# EAGLE design CC110L_Breakout (EAGLE 7.1.0)
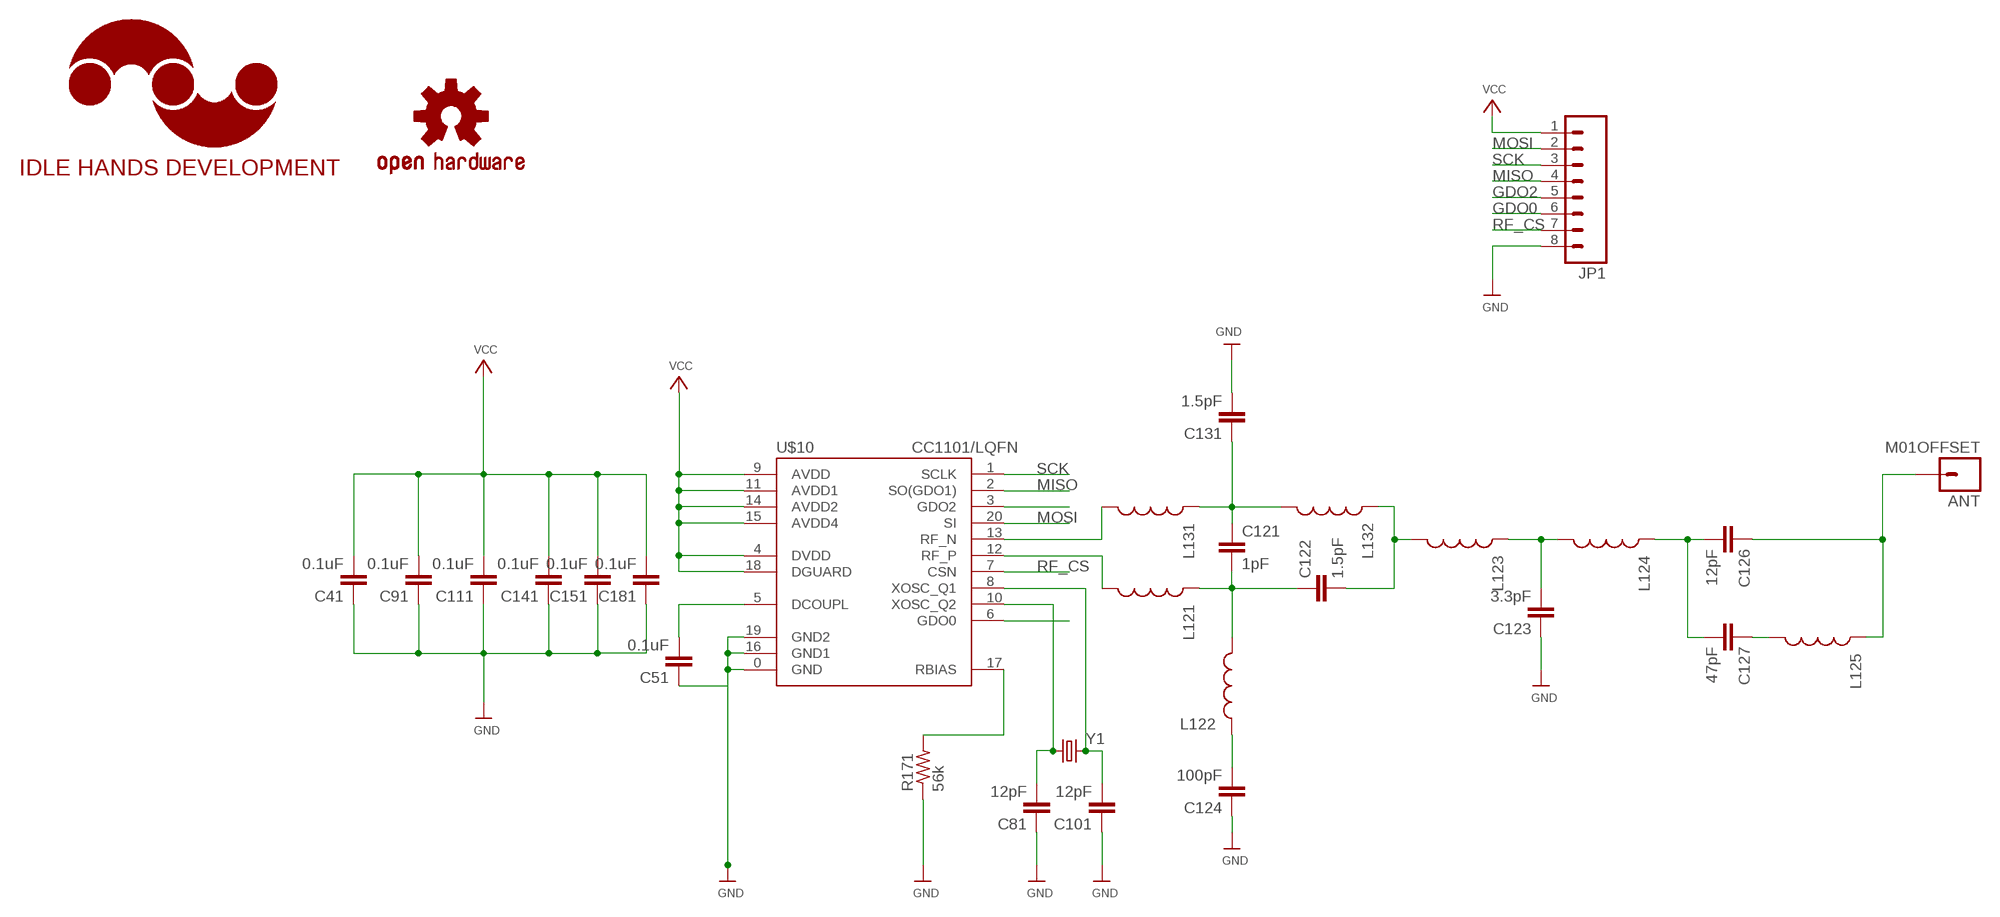
[diagram p0: schematic, sheet 1]

## Parts
ANT  M01OFFSET  [1X01_OFFSET]
C41  0.1uF  C-EUC0402  [C0402]
C51  0.1uF  C-EUC0402  [C0402]
C81  12pF  C-EUC0402  [C0402]
C91  0.1uF  C-EUC0402  [C0402]
C101  12pF  C-EUC0402  [C0402]
C111  0.1uF  C-EUC0402  [C0402]
C121  1pF  C-EUC0402  [C0402]
C122  1.5pF  C-EUC0402  [C0402]
C123  3.3pF  C-EUC0402  [C0402]
C124  100pF  C-EUC0402  [C0402]
C126  12pF  C-EUC0402  [C0402]
C127  47pF  C-EUC0402  [C0402]
C131  1.5pF  C-EUC0402  [C0402]
C141  0.1uF  C-EUC0402  [C0402]
C151  0.1uF  C-EUC0402  [C0402]
C181  0.1uF  C-EUC0402  [C0402]
JP1  M08LOCK  [1X08_LOCK]
L121  INDUCTOR0402  [C0402]
L122  INDUCTOR0402  [C0402]
L123  INDUCTOR0402  [C0402]
L124  INDUCTOR0402  [C0402]
L125  INDUCTOR0402  [C0402]
L131  INDUCTOR0402  [C0402]
L132  INDUCTOR0402  [C0402]
LOGO1  OSHW-LOGOS  [OSHW-LOGO-S]
LOGO2  IDLEHANDS_LOGOS  [IHD-LOGO-S]
R171  56k  R-US_R0402  [R0402]
U$10  CC1101/LQFN  [QFN20]
Y1  CRYSTAL3.2X2.5  [CRYSTAL-SMD-3.2X2.5]

## Nets
GDO0: JP1.6 U$10.6(GDO0)
GDO2: JP1.5 U$10.3(GDO2)
GND: C41.1 C51.1 C81.1 C91.1 C101.1 C111.1 C123.1 C124.1 C131.2 C141.1 C151.1 C181.1 JP1.8 R171.1 U$10.0(GND) U$10.16(GND1) U$10.19(GND2)
MISO: JP1.4 U$10.2(SO(GDO1))
MOSI: JP1.2 U$10.20(SI)
N$1: L131.2 U$10.13(RF_N)
N$2: C121.1 C131.1 L131.1 L132.2
N$4: L121.2 U$10.12(RF_P)
N$5: C121.2 C122.1 L121.1 L122.2
N$6: C124.2 L122.1
N$7: C122.2 L123.2 L132.1
N$8: C123.2 L123.1 L124.2
N$9: C126.2 C127.2 L124.1
N$10: C127.1 L125.2
N$11: ANT.1 C126.1 L125.1
N$12: C101.2 U$10.8(XOSC_Q1) Y1.3
N$13: C81.2 U$10.10(XOSC_Q2) Y1.1
N$14: C51.2 U$10.5(DCOUPL)
N$16: R171.2 U$10.17(RBIAS)
RF_CS: JP1.7 U$10.7(CSN)
SCK: JP1.3 U$10.1(SCLK)
VCC: C41.2 C91.2 C111.2 C141.2 C151.2 C181.2 JP1.1 U$10.4(DVDD) U$10.9(AVDD) U$10.11(AVDD1) U$10.14(AVDD2) U$10.15(AVDD4) U$10.18(DGUARD)

## Library data of the parts
ANT = SparkFun-Connectors:M01: Header 1 Standard 1-pin 0.1" header. Use with straight break away headers (SKU : PRT-00116), right angle break away headers (PRT-00553), swiss pins (PRT-00743), machine pins (PRT-00117), and female headers (PRT-00115).
C41 C51 C81 C91 C101 C111 C121-C124 C126 C127 C131 C141 C151 C181 = rcl:C-EU: CAPACITOR, European symbol
JP1 = SparkFun-Connectors:M08: Header 8 Standard 8-pin 0.1" header. Use with straight break away headers (SKU : PRT-00116), right angle break away headers (PRT-00553), swiss pins (PRT-00743), machine pins (PRT-00117), and female headers (PRT-00115).
L121-L125 L131 L132 = SparkFun-Passives:INDUCTOR: Inductors Basic Inductor/Choke - 0603 and 1206. Footprints are not proven and vary greatly between part numbers. SRN6045- 33uH, 20% 1.4A SDR0403-560KL - 56uH, 10%, 500mA RMS/740mA peak
LOGO1 = SparkFun-Aesthetics:OSHW-LOGO: Open Source Hardware Logo This logo indicates the piece of hardware it is found on incorporates a OSHW license and/or adheres to the definition of open source hardware found here: http://freedomdefined.org/OSHW
LOGO2 = IdleHandsProject:IDLEHANDS_LOGO: Open Source Hardware Logo This logo indicates the piece of hardware it is found on incorporates a OSHW license and/or adheres to the definition of open source hardware found here: http://freedomdefined.org/OSHW
R171 = rcl:R-US_: RESISTOR, American symbol
U$10 = anoven:CC1101/L: TI CC1101/L 4mmx4mm QFN-20 http://www.ti.com/product/cc110L
Y1 = SparkFun-FreqCtrl:CRYSTAL: Various standard crystals. Proven footprints. Spark Fun Electronics SKU : COM-00534

## Net classes
0 default: width 0.203 mm

## Board
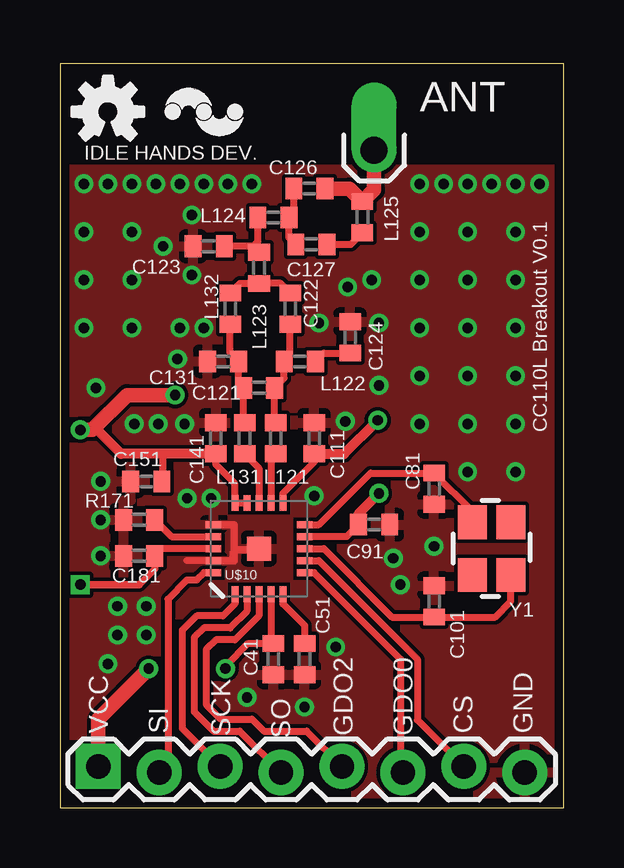
[diagram p1: board, top side]
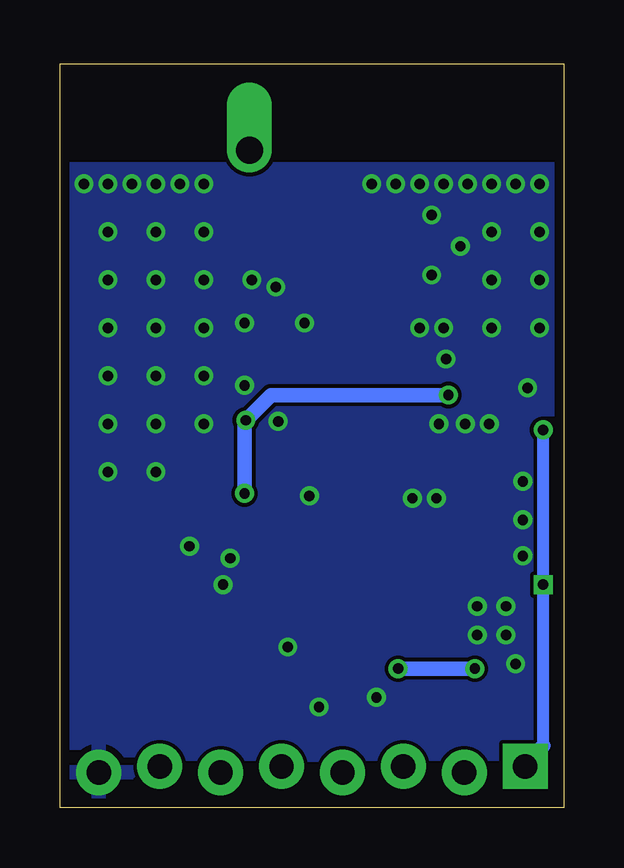
[diagram p2: board, bottom side, seen from below]

Size 21 x 31 mm. Coordinates in mm from the lower left corner, seen from the top.
Outline: 0,0 21,0 21,31 0,31 0,0
Copper layers (1*16): Top 0.0356mm / dielectric 1.5011mm / Bottom 0.0356mm
Design rules "LaenPCBOrder": minimum track width 6mil, minimum drill 13mil, track to track 6mil, track to pad 6mil, pad to pad 6mil, via to via 6mil, smd to smd 6mil, copper to edge 15mil, drill to drill 6mil, minimum pad ring 7mil, minimum via ring 7mil, stop-mask expansion 3mil, vias tented up to drill 0mil, thermal gap 10mil

### Footprints (pad centres in the part's own frame; a part is rotated, then mirrored left to right if it is on the bottom)
1X01_OFFSET = drill 1.118 pad 1.88 offset: 1 0,0
C0402 = smd 0.7 x 0.9: 1 -0.65,0; 2 0.65,0
1X08_LOCK = drill 1.016 pad 1.88 square: 1 0,0.127 | drill 1.016 pad 1.88: 2 2.54,-0.127; 3 5.08,0.127; 4 7.62,-0.127; 5 10.16,0.127; 6 12.7,-0.127; 7 15.24,0.127; 8 17.78,-0.127
R0402 = smd 0.7 x 0.9: 1 -0.65,0; 2 0.65,0
QFN20 = smd 1 x 1: 0 0,0 | smd 0.65 x 0.3: 1 -1.9,1; 2 -1.9,0.5; 3 -1.9,0; 4 -1.9,-0.5; 5 -1.9,-1; 11 1.9,-1; 12 1.9,-0.5; 13 1.9,0; 14 1.9,0.5; 15 1.9,1 | smd 0.3 x 0.65: 6 -1,-1.9; 7 -0.5,-1.9; 8 0,-1.9; 9 0.5,-1.9; 10 1,-1.9; 16 1,1.9; 17 0.5,1.9; 18 0,1.9; 19 -0.5,1.9; 20 -1,1.9
CRYSTAL-SMD-3.2X2.5 = smd 1.4 x 1.2: 1 -1.1,-0.8; 2 1.1,-0.8; 3 1.1,0.8; 4 -1.1,0.8

### Placement (x,y rotation side)
ANT  13.1,27.4 0 top
C41  8.9,6.2 90 top
C51  10.2,6.2 90 top
C81  15.6,13.3 90 top
C91  13.1,11.8 180 top
C101  15.6,8.6 270 top
C111  10.6,15.4 270 top
C121  8.3,17.5 0 top
C122  9.6,20.8 90 top
C123  6.2,23.4 0 top
C124  12.1,19.6 270 top
C126  10.4,25.8 180 top
C127  10.48,23.48 180 top
C131  6.8,18.6 180 top
C141  6.5,15.4 270 top
C151  3.6,13.6 0 top
C181  3.3,10.5 0 top
JP1  1.6,1.6 0 top
L121  9,15.4 270 top
L122  10,18.6 180 top
L123  8.3,22.5 270 top
L124  8.9,24.6 180 top
L125  12.61,24.61 270 top
L131  7.7,15.4 270 top
L132  7.1,20.8 270 top
LOGO1  2,29 0 top
LOGO2  6,29 180 top
R171  3.3,12 0 top
U$10  8.3,10.8 90 top
Y1  18,10.8 270 top

### Tracks (layer width: path | path; a pad name or v marks a point on that pad's centre or on a via)
GDO0
  Top 0.3: U$10.6 10.6,9.8 14.2,6.2 14.2,1.57 JP1.6
GDO2
  Top 0.3: U$10.3 8.3,8 7.3,7 6.5,7 6.1,6.6 6.1,4.3 6.7,3.7 8,3.7 8.5,3.2 10.29,3.2 JP1.5
GND  (via drill 0.43)
  Top 0.3: U$10.19 5.3,10.3
  Top 0.305: 7.2,10.3 7.25,10.3 7.25,10.75 | 7.25,10.75 7.25,11.8 U$10.16 | U$10.0 8.3,10.75 7.25,10.75 | 7.25,10.75 7.2,10.3 | 7.2,10.3 U$10.19
  other vias: 7.8,4.6 10.2,4.2 11.5,6.7 14.2,9.3 15.6,10.9 13.9,10.4 6.3,12.9 5.3,12.9 5.2,16 3.6,8.4 3.6,7.2 2.4,8.4 2.4,7.2 4.1,16 3.1,16 10.6,13 11.9,16.1 13.3,17.6 13.3,20.2 12,21.7 10.8,20.2 6,20 4.9,18.7 5.5,22.2 4.3,23.4 5.5,24.7 1.5,17.5 2,6 1.7,13.6 1.7,12 1.7,10.5 15,26 16,26 17,26 18,26 19,26 7,26 6,26 5,26 4,26 3,26 2,26 1,26 8,26 20,26 1,24 3,24 1,22 3,22 3,20 1,20 5,20 15,24 17,24 19,24 15,22 13,22 17,22 19,22 19,20 17,20 15,20 15,18 17,18 19,18 19,16 17,16 15,16 17,14 19,14
  pour Top: 0,0 0,26.6 21,26.6 21,0
  pour Bottom: 0,0 0,26.6 21,26.6 21,0
MISO
  Top 0.3: U$10.2 7.8,8.2 7.1,7.5 6,7.5 5.6,7.1 5.6,4 6.4,3.2 7.49,3.2 JP1.4
MOSI
  Top 0.3: JP1.2 4.5,1.83 4.5,8.7 5.3,9.5 5.7,9.5 6,9.8 U$10.20
N$1
  Top 0.3: L131.2 8.3,14.15 U$10.13
N$2
  Top 0.3: L131.1 7.65,16.1 C121.1 7.45,17.7 C131.1 7.1,18.95 L132.2
N$4
  Top 0.3: L121.2 8.8,14.55 U$10.12
N$5
  Top 0.3: L121.1 8.95,16.1 C121.2 9.35,17.9 L122.2 9.6,18.85 C122.1
N$6
  Top 0.3: L122.1 11,18.95 C124.2
N$7
  Top 0.3: L132.1 7.5,21.85 L123.2 9.2,21.85 C122.2
N$8
  Top 0.3: L123.1 8.05,23.4 | 8.05,23.4 C123.2 | 8.05,23.4 8.25,23.6 L124.2
N$9
  Top 0.3: C127.2 9.55,23.76 L124.1 9.75,24.8 C126.2
N$10
  Top 0.3: C127.1 12.13,23.48 L125.2
N$11
  Top 0.61: C126.1 12.07,25.8 L125.1 13.1,25.75 ANT.1
N$12
  Top 0.3: U$10.8 11,10.8 13.85,7.95 C101.2 | 15.45,8.1 C101.2 | Y1.3 18.8,8.6 18.15,7.95 C101.2
N$13
  Top 0.3: U$10.10 10.8,11.8 12.95,13.95 C81.2 17.2,12.35 Y1.1
N$14
  Top 0.3: U$10.5 9.3,8.5 10.2,7.6 C51.2
N$16
  Top 0.3: R171.2 4.65,11.3 U$10.17
RF_CS
  Top 0.3: U$10.7 10.8,10.3 14.9,6.2 14.9,3.67 JP1.7
SCK
  Top 0.3: U$10.1 7.3,8.5 6.8,8 5.7,8 5.1,7.4 5.1,3.31 JP1.3
VCC  (via drill 0.43)
  Top 0.3: U$10.9 11.95,11.3 C91.2 | U$10.4 8.8,6.95 C41.2 7.85,6.85 6.9,5.9 v6.9,5.8 | U$10.11 9.3,13.1 10.6,14.4 C111.2 | C141.2 6.5,14.3 7.3,13.5 U$10.15 U$10.14 | C151.2 4.3,13.65 4.3,14.75 | U$10.18 4.25,10.8 C181.2 3.95,9.95 3.3,9.3
  Top 0.305: 3.3,9.3 v0.85,9.3 0.65,9.3
  Top 0.406: C91.2 12.45,12.25 v13.3,13.1 | C111.2 11.85,14.75 v13.25,16.15 | C141.2 4.3,14.75 2.55,14.75 1.55,15.75 1.3,15.75
  Top 0.61: v4.8,17.2 2.8,17.2 1.35,15.75 1.3,15.75 v0.85,15.75 | JP1.1 1.6,3.7 v3.7,5.8
  Bottom 0.406: v13.25,16.15 13.25,15.65 13.3,15.6
  Bottom 0.5: 0.85,2.58 v0.85,9.3 v0.85,15.75
  Bottom 0.61: v13.3,13.1 13.3,15.6 13.3,16.1 v13.25,16.15 12.2,17.2 v4.8,17.2 | v3.7,5.8 v6.9,5.8 | JP1.1 0.85,2.58

### Text on the board
tNames: IDLE HANDS DEV. | CC110L Breakout V0.1 | VCC | SI | SCK | SO | GDO2 | GDO0 | CS | GND